# EAGLE design Robotic armmodified 3pin (EAGLE 9.0.1)
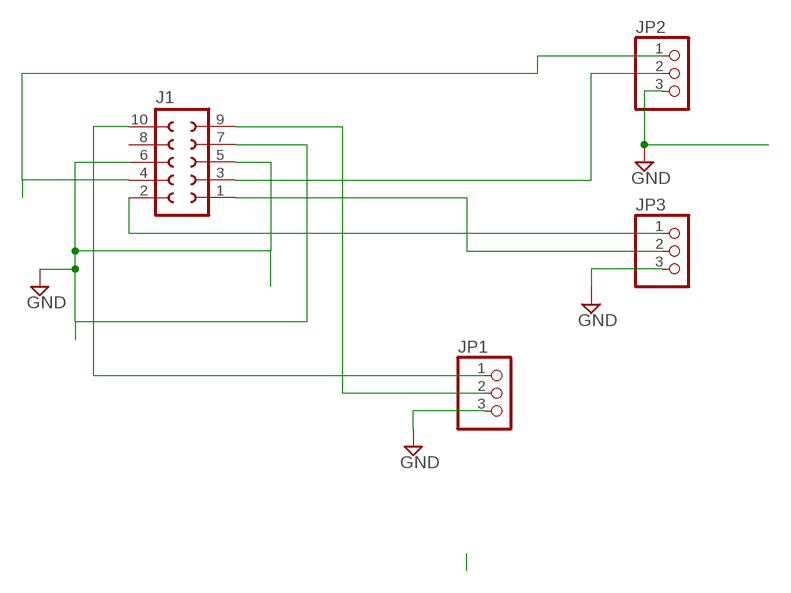
[diagram p0: schematic, sheet 1]

## Parts
J1  SOCKET-10V  [S10V]
JP1  PINHD-1X3  [1X03]
JP2  PINHD-1X3  [1X03]
JP3  PINHD-1X3  [1X03]
MRM1  MRM  [LOL]

## Nets
GND: J1.5 J1.6 J1.7 JP1.3 JP2.3 JP3.3
N$1: J1.10 JP1.1
N$2: J1.9 JP1.2
N$4: J1.1 JP3.2
N$5: J1.2 JP3.1
N$6: J1.3 JP2.2
N$7: J1.4 JP2.1
Unconnected: J1.8

## Library data of the parts
J1 = con-3m-skt-header:SOCKET-10: 10 pin PCB Socket (3m 85xx/51xx)
JP1-JP3 = pinhead:PINHD-1X3: PIN HEADER
MRM1 = MRM:MRM

## Board
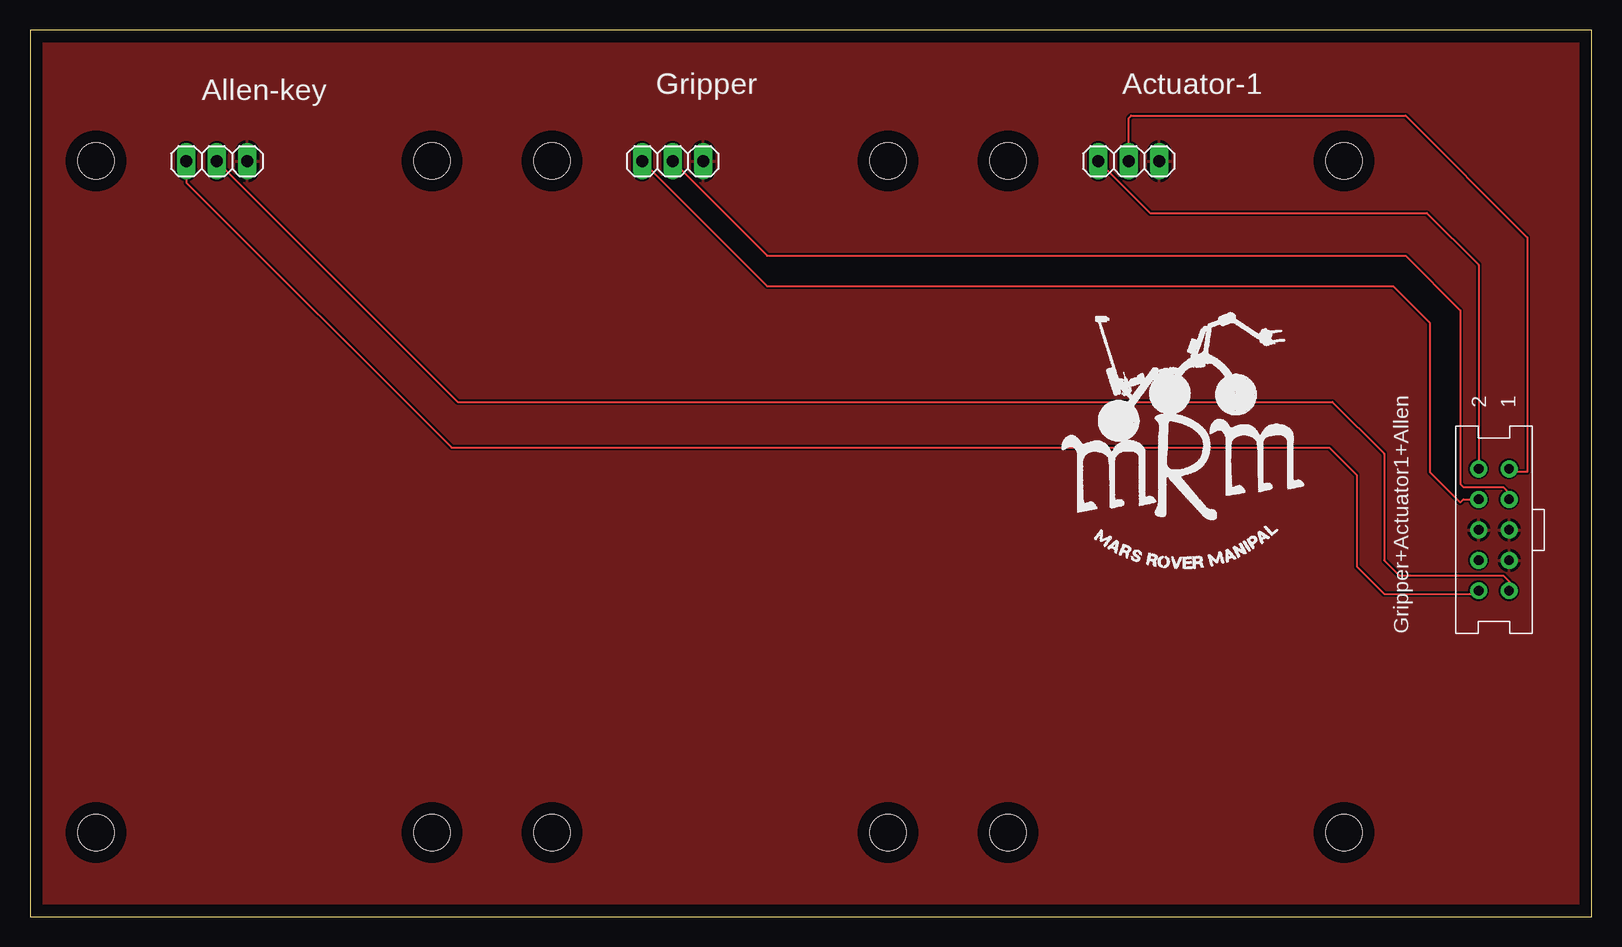
[diagram p1: board, top side]

Size 130.14 x 73.92 mm. Coordinates in mm from the lower left corner, seen from the top.
Outline: 0,0 130.14,0 130.14,73.92 0,73.92 0,0
Copper layers (1*16): Top 0.035mm / dielectric 1.5mm / Bottom 0.035mm
Design rules "default": minimum track width 6mil, minimum drill 0.35mm, track to track 6mil, track to pad 6mil, pad to pad 6mil, via to via 6mil, smd to smd 6mil, copper to edge 40mil, drill to drill 6mil, minimum pad ring 10mil, minimum via ring 8mil, stop-mask expansion 4mil, vias tented up to drill 0mil, thermal gap 10mil
Holes 3 mm at 5.5,63 33.5,63 33.5,7 5.5,7 43.5,63 43.5,7 71.5,63 71.5,7 81.5,63 109.5,63 81.5,7 109.5,7

### Footprints (pad centres in the part's own frame; a part is rotated, then mirrored left to right if it is on the bottom)
S10V = drill 0.8 pad 1.4: 1 5.08,-1.27; 2 5.08,1.27; 3 2.54,-1.27; 4 2.54,1.27; 5 0,-1.27; 6 0,1.27; 7 -2.54,-1.27; 8 -2.54,1.27; 9 -5.08,-1.27; 10 -5.08,1.27
1X03 = drill 1.016 long: 1 -2.54,0; 2 0,0; 3 2.54,0

### Placement (x,y rotation side)
J1  122,32.24 90 top
JP1  15.57,62.98 0 top
JP2  53.56,62.98 0 top
JP3  91.56,62.98 0 top
MRM1  93.54,38.41 0 top

### Tracks (layer width: path | path; a pad name or v marks a point on that pad's centre or on a via)
GND
  pour Top: -0.18,74.15 130.38,74.15 130.38,69.83 130.38,-0.02 126.06,-0.02 0.08,-0.02 0.08,0.24 -0.18,0.24
N$1
  Top 0.152: JP1.1 13.03,61.2 35.13,39.1 108.28,39.1 110.57,36.81 110.57,29.19 112.85,26.91 120.47,26.91 J1.10
N$2
  Top 0.152: JP1.2 35.64,42.91 108.53,42.91 112.85,38.59 112.85,29.7 114.12,28.43 122.76,28.43 123.27,27.92 J1.9
N$4
  Top 0.152: JP3.2 91.56,66.58 91.77,66.79 114.63,66.79 124.79,56.63 124.79,37.07 123.52,37.07 J1.1
N$5
  Top 0.152: JP3.1 93.34,58.66 116.41,58.66 120.73,54.34 J1.2
N$6
  Top 0.152: JP2.2 61.43,55.1 114.63,55.1 119.2,50.53 119.2,36.05 119.46,35.8 122.76,35.8 123.27,35.29 J1.3
N$7
  Top 0.152: JP2.1 61.43,52.56 113.61,52.56 116.66,49.51 116.66,37.07 119.2,34.53 119.46,34.78 J1.4

### Text on the board
tPlace: Gripper+Actuator1+Allen
tNames: Gripper | Actuator-1 | Allen-key